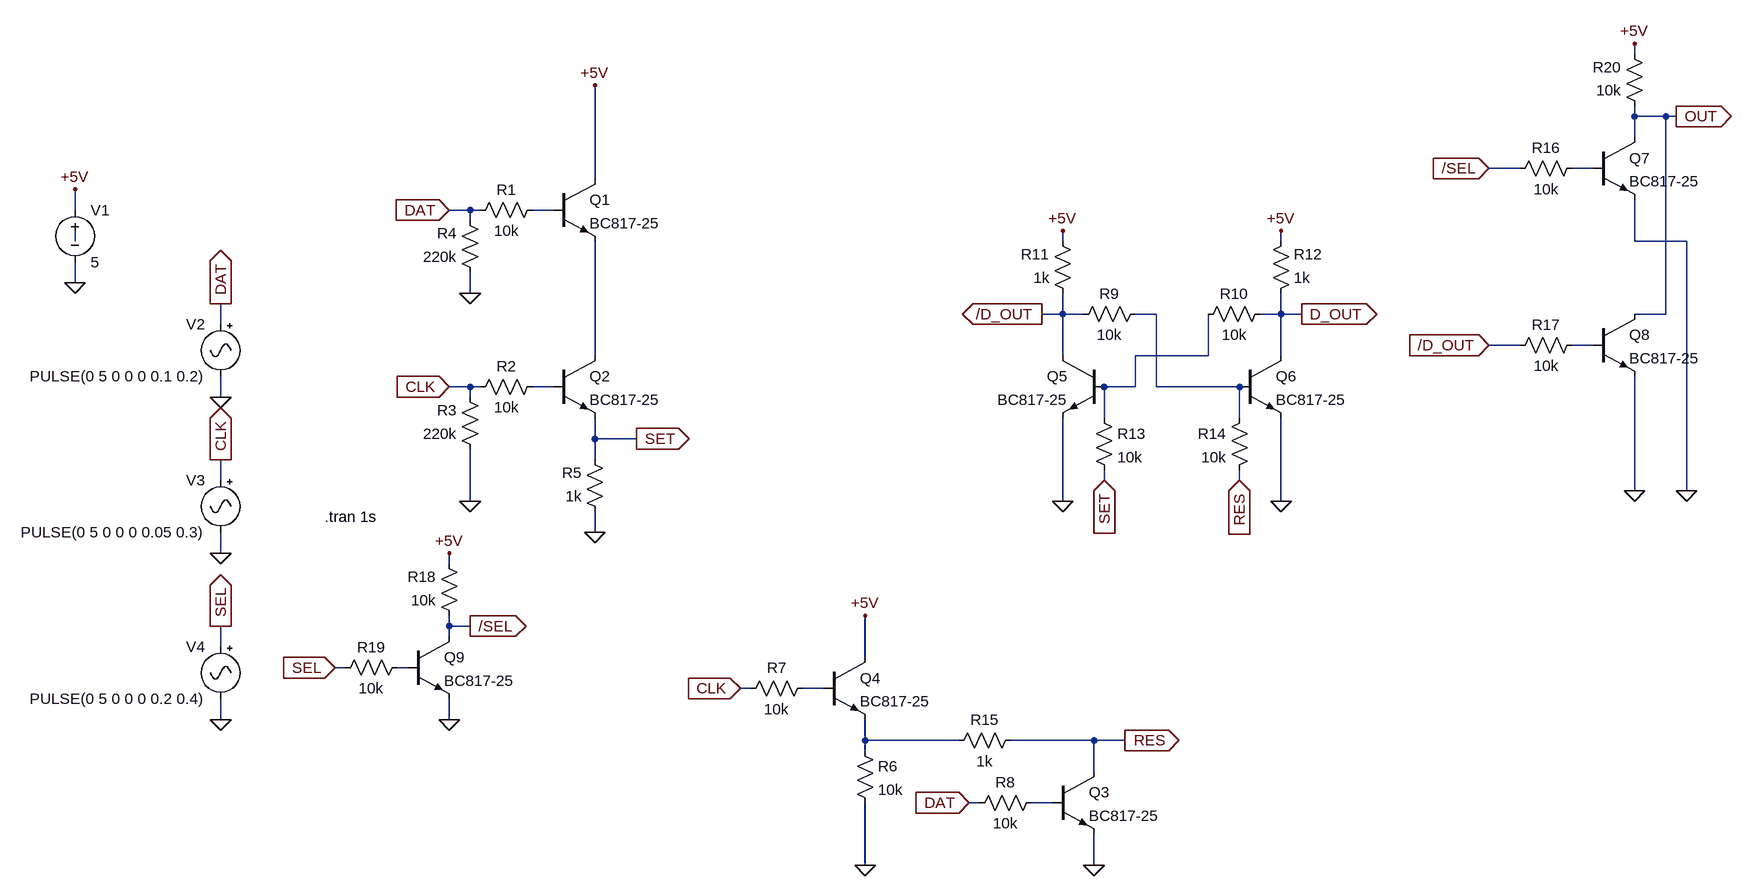
[diagram p0: schematic register.asc]
register.asc, the LTspice schematic file:
Version 4
SHEET 1 1972 1044
WIRE 1792 -224 1792 -240
WIRE 1792 -128 1792 -144
WIRE 1840 -128 1792 -128
WIRE 1856 -128 1840 -128
WIRE 1792 -96 1792 -128
WIRE 1616 -48 1568 -48
WIRE 1728 -48 1696 -48
WIRE 192 -32 192 -176
WIRE -608 16 -608 -16
WIRE 0 16 -32 16
WIRE 16 16 0 16
WIRE 128 16 96 16
WIRE 0 32 0 16
WIRE -608 64 -608 48
WIRE 912 64 912 48
WIRE 1248 64 1248 48
WIRE 1792 64 1792 0
WIRE 1872 64 1792 64
WIRE -608 128 -608 96
WIRE 0 144 0 112
WIRE 912 176 912 144
WIRE 912 176 880 176
WIRE 944 176 912 176
WIRE 1056 176 1024 176
WIRE 1248 176 1248 144
WIRE 1248 176 1216 176
WIRE 1280 176 1248 176
WIRE 1840 176 1840 -128
WIRE 1840 176 1792 176
WIRE -384 192 -384 160
WIRE 1616 224 1568 224
WIRE 1728 224 1696 224
WIRE 192 240 192 64
WIRE 912 240 912 176
WIRE 1136 240 1136 176
WIRE 1136 240 1024 240
WIRE 1248 240 1248 176
WIRE 0 288 -32 288
WIRE 16 288 0 288
WIRE 128 288 96 288
WIRE 1024 288 1024 240
WIRE 1024 288 976 288
WIRE 1056 288 1056 176
WIRE 1184 288 1056 288
WIRE -384 304 -384 272
WIRE 0 304 0 288
WIRE 976 336 976 288
WIRE 1184 336 1184 288
WIRE 192 368 192 336
WIRE 256 368 192 368
WIRE 192 400 192 368
WIRE -384 432 -384 400
WIRE 976 432 976 416
WIRE 1184 432 1184 416
WIRE 1792 448 1792 272
WIRE 1872 448 1872 64
WIRE 0 464 0 384
WIRE 912 464 912 336
WIRE 1248 464 1248 336
WIRE 192 512 192 480
WIRE -384 544 -384 512
WIRE -32 560 -32 544
WIRE -32 656 -32 640
WIRE 0 656 -32 656
WIRE -32 672 -32 656
WIRE -384 688 -384 656
WIRE 608 704 608 640
WIRE -192 720 -208 720
WIRE -96 720 -112 720
WIRE 432 752 416 752
WIRE 544 752 512 752
WIRE -384 800 -384 768
WIRE -32 800 -32 768
WIRE 608 832 608 800
WIRE 752 832 608 832
WIRE 960 832 832 832
WIRE 1008 832 960 832
WIRE 608 848 608 832
WIRE 960 880 960 832
WIRE 784 928 768 928
WIRE 896 928 864 928
WIRE 608 1024 608 928
WIRE 960 1024 960 976
FLAG 192 512 0
FLAG 0 144 0
FLAG 0 464 0
FLAG -608 128 0
FLAG -384 304 0
FLAG -384 544 0
FLAG 416 752 CLK
IOPIN 416 752 In
FLAG 912 464 0
FLAG 1248 464 0
FLAG 976 432 SET
IOPIN 976 432 In
FLAG 1184 432 RES
IOPIN 1184 432 In
FLAG 880 176 /D_OUT
IOPIN 880 176 Out
FLAG 1280 176 D_OUT
IOPIN 1280 176 Out
FLAG -608 -16 +5V
FLAG 192 -176 +5V
FLAG 608 640 +5V
FLAG 912 48 +5V
FLAG 1248 48 +5V
FLAG -384 160 DAT
IOPIN -384 160 Out
FLAG -384 400 CLK
IOPIN -384 400 Out
FLAG -32 16 DAT
IOPIN -32 16 In
FLAG -32 288 CLK
IOPIN -32 288 In
FLAG 256 368 SET
IOPIN 256 368 Out
FLAG 608 1024 0
FLAG 960 1024 0
FLAG 1008 832 RES
IOPIN 1008 832 Out
FLAG 768 928 DAT
IOPIN 768 928 In
FLAG 1792 448 0
FLAG 1792 -240 +5V
FLAG 1568 -48 /SEL
IOPIN 1568 -48 In
FLAG 1568 224 /D_OUT
IOPIN 1568 224 In
FLAG 1856 -128 OUT
IOPIN 1856 -128 Out
FLAG -384 800 0
FLAG -384 656 SEL
IOPIN -384 656 Out
FLAG 1872 448 0
FLAG -32 800 0
FLAG -32 544 +5V
FLAG -208 720 SEL
IOPIN -208 720 In
FLAG 0 656 /SEL
IOPIN 0 656 Out
SYMBOL npn 128 -32 R0
SYMATTR InstName Q1
SYMATTR Value BC817-25
SYMBOL npn 128 240 R0
SYMATTR InstName Q2
SYMATTR Value BC817-25
SYMBOL voltage -608 0 R0
WINDOW 123 0 0 Left 2
WINDOW 39 0 0 Left 2
SYMATTR InstName V1
SYMATTR Value 5
SYMBOL res 112 0 R90
WINDOW 0 0 56 VBottom 2
WINDOW 3 32 56 VTop 2
SYMATTR InstName R1
SYMATTR Value 10k
SYMBOL res 112 272 R90
WINDOW 0 0 56 VBottom 2
WINDOW 3 32 56 VTop 2
SYMATTR InstName R2
SYMATTR Value 10k
SYMBOL res 16 400 R180
WINDOW 0 36 76 Left 2
WINDOW 3 36 40 Left 2
SYMATTR InstName R3
SYMATTR Value 220k
SYMBOL res 16 128 R180
WINDOW 0 36 76 Left 2
WINDOW 3 36 40 Left 2
SYMATTR InstName R4
SYMATTR Value 220k
SYMBOL res 208 496 R180
WINDOW 0 36 76 Left 2
WINDOW 3 36 40 Left 2
SYMATTR InstName R5
SYMATTR Value 1k
SYMBOL Misc\\signal -384 176 M0
WINDOW 123 0 0 Left 2
WINDOW 39 0 0 Left 2
SYMATTR InstName V2
SYMATTR Value PULSE(0 5 0 0 0 0.1 0.2)
SYMBOL Misc\\signal -384 416 M0
WINDOW 123 0 0 Left 2
WINDOW 39 0 0 Left 2
SYMATTR InstName V3
SYMATTR Value PULSE(0 5 0 0 0 0.05 0.3)
SYMBOL npn 896 880 R0
SYMATTR InstName Q3
SYMATTR Value BC817-25
SYMBOL npn 544 704 R0
SYMATTR InstName Q4
SYMATTR Value BC817-25
SYMBOL res 592 832 R0
SYMATTR InstName R6
SYMATTR Value 10k
SYMBOL res 528 736 R90
WINDOW 0 0 56 VBottom 2
WINDOW 3 32 56 VTop 2
SYMATTR InstName R7
SYMATTR Value 10k
SYMBOL res 880 912 R90
WINDOW 0 0 56 VBottom 2
WINDOW 3 32 56 VTop 2
SYMATTR InstName R8
SYMATTR Value 10k
SYMBOL npn 976 240 M0
SYMATTR InstName Q5
SYMATTR Value BC817-25
SYMBOL npn 1184 240 R0
SYMATTR InstName Q6
SYMATTR Value BC817-25
SYMBOL res 1040 160 R90
WINDOW 0 0 56 VBottom 2
WINDOW 3 32 56 VTop 2
SYMATTR InstName R9
SYMATTR Value 10k
SYMBOL res 1232 160 R90
WINDOW 0 0 56 VBottom 2
WINDOW 3 32 56 VTop 2
SYMATTR InstName R10
SYMATTR Value 10k
SYMBOL res 928 160 R180
WINDOW 0 36 76 Left 2
WINDOW 3 36 40 Left 2
SYMATTR InstName R11
SYMATTR Value 1k
SYMBOL res 1232 160 M180
WINDOW 0 36 76 Left 2
WINDOW 3 36 40 Left 2
SYMATTR InstName R12
SYMATTR Value 1k
SYMBOL res 960 320 R0
SYMATTR InstName R13
SYMATTR Value 10k
SYMBOL res 1200 320 M0
SYMATTR InstName R14
SYMATTR Value 10k
SYMBOL res 848 816 R90
WINDOW 0 0 56 VBottom 2
WINDOW 3 32 56 VTop 2
SYMATTR InstName R15
SYMATTR Value 1k
SYMBOL npn 1728 -96 R0
SYMATTR InstName Q7
SYMATTR Value BC817-25
SYMBOL npn 1728 176 R0
SYMATTR InstName Q8
SYMATTR Value BC817-25
SYMBOL res 1712 -64 R90
WINDOW 0 0 56 VBottom 2
WINDOW 3 32 56 VTop 2
SYMATTR InstName R16
SYMATTR Value 10k
SYMBOL res 1712 208 R90
WINDOW 0 0 56 VBottom 2
WINDOW 3 32 56 VTop 2
SYMATTR InstName R17
SYMATTR Value 10k
SYMBOL res 1808 -128 R180
WINDOW 0 36 76 Left 2
WINDOW 3 36 40 Left 2
SYMATTR InstName R20
SYMATTR Value 10k
SYMBOL Misc\\signal -384 672 M0
WINDOW 123 0 0 Left 2
WINDOW 39 0 0 Left 2
SYMATTR InstName V4
SYMATTR Value PULSE(0 5 0 0 0 0.2 0.4)
SYMBOL npn -96 672 R0
SYMATTR InstName Q9
SYMATTR Value BC817-25
SYMBOL res -16 656 R180
WINDOW 0 36 76 Left 2
WINDOW 3 36 40 Left 2
SYMATTR InstName R18
SYMATTR Value 10k
SYMBOL res -96 704 R90
WINDOW 0 0 56 VBottom 2
WINDOW 3 32 56 VTop 2
SYMATTR InstName R19
SYMATTR Value 10k
TEXT -224 488 Left 2 !.tran 1s

The netlist it stands for:
* register.asc
Q1 +5V N002 N006 0 BC817-25
Q2 N006 N008 SET 0 BC817-25
V1 +5V 0 5
R1 N002 DAT 10k
R2 N008 CLK 10k
R3 0 CLK 220k
R4 0 DAT 220k
R5 0 SET 1k
V2 DAT 0 PULSE(0 5 0 0 0 0.1 0.2)
V3 CLK 0 PULSE(0 5 0 0 0 0.05 0.3)
Q3 RES N012 0 0 BC817-25
Q4 +5V N010 N011 0 BC817-25
R6 N011 0 10k
R7 N010 CLK 10k
R8 N012 DAT 10k
Q5 /D_OUT N007 0 0 BC817-25
Q6 D_OUT N004 0 0 BC817-25
R9 N004 /D_OUT 10k
R10 D_OUT N007 10k
R11 /D_OUT +5V 1k
R12 D_OUT +5V 1k
R13 N007 SET 10k
R14 N004 RES 10k
R15 RES N011 1k
Q7 OUT N001 0 0 BC817-25
Q8 OUT N005 0 0 BC817-25
R16 N001 /SEL 10k
R17 N005 /D_OUT 10k
R20 OUT +5V 10k
V4 SEL 0 PULSE(0 5 0 0 0 0.2 0.4)
Q9 /SEL N009 0 0 BC817-25
R18 /SEL +5V 10k
R19 N009 SEL 10k
.model NPN NPN
.model PNP PNP
.lib standard.bjt
.tran 1s
.backanno
.end